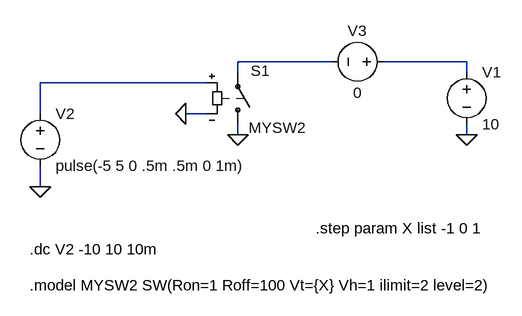
[diagram p0: schematic NewVswitch2D.asc]
NewVswitch2D.asc, the LTspice schematic file:
Version 4
SHEET 1 1276 680
WIRE 384 128 240 128
WIRE 592 128 464 128
WIRE 240 144 240 128
WIRE 592 144 592 128
WIRE 192 160 -64 160
WIRE -64 208 -64 160
WIRE 192 208 160 208
WIRE 240 240 240 224
WIRE 592 240 592 224
WIRE -64 320 -64 288
FLAG -64 320 0
FLAG 592 240 0
FLAG 240 240 0
FLAG 160 208 0
SYMBOL voltage 592 128 R0
SYMATTR Value 10
SYMATTR InstName V1
SYMBOL sw 240 240 M180
WINDOW 0 20 98 Left 2
WINDOW 3 17 11 Left 2
SYMATTR InstName S1
SYMATTR Value MYSW2
SYMBOL voltage -64 192 R0
SYMATTR InstName V2
SYMATTR Value pulse(-5 5 0 .5m .5m 0 1m)
SYMBOL voltage 480 128 R90
WINDOW 0 -32 56 VBottom 2
WINDOW 3 32 56 VTop 2
WINDOW 123 74 56 VTop 2
WINDOW 39 53 56 VTop 2
SYMATTR InstName V3
SYMATTR Value 0
TEXT -80 416 Left 2 !.dc V2 -10 10 10m
TEXT -80 472 Left 2 !.model MYSW2 SW(Ron=1 Roff=100 Vt={X} Vh=1 ilimit=2 level=2)
TEXT 360 384 Left 2 !.step param X list -1 0 1

The netlist it stands for:
* NewVswitch2D.asc
V1 N002 0 10
S1 0 N001 N003 0 MYSW2
V2 N003 0 pulse(-5 5 0 .5m .5m 0 1m)
V3 N002 N001 0
.dc V2 -10 10 10m
.model MYSW2 SW(Ron=1 Roff=100 Vt={X} Vh=1 ilimit=2 level=2)
.step param X list -1 0 1
.backanno
.end